# Altium schematic sheet Main.SchDoc
size A4
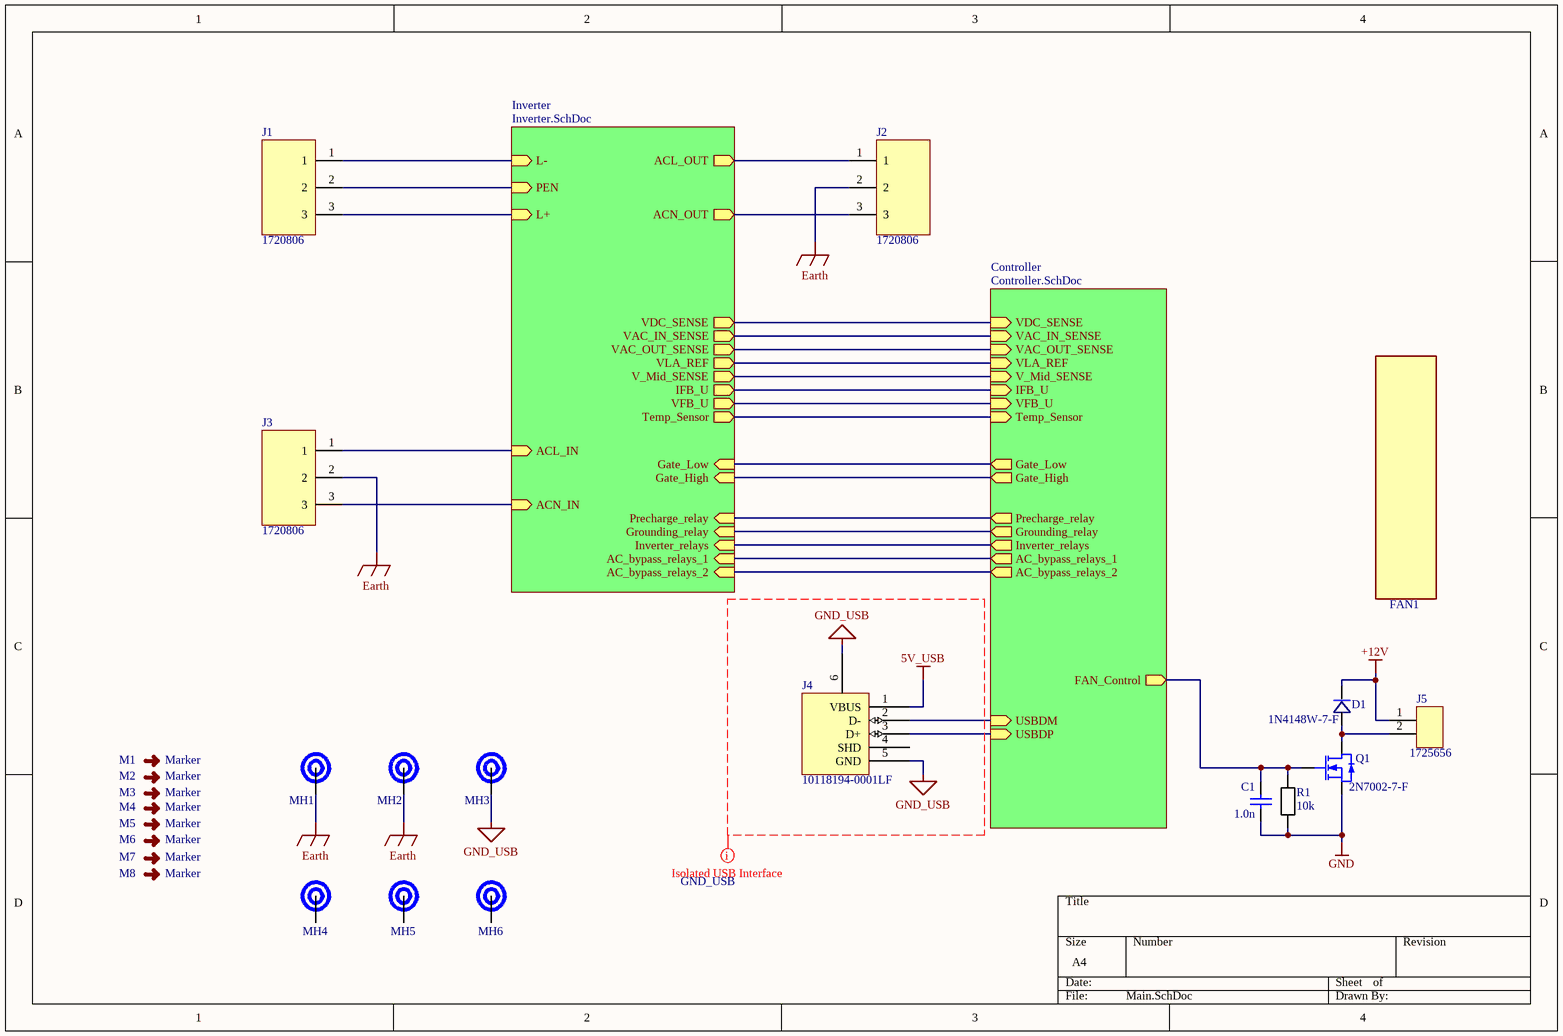
[diagram p0: Main.SchDoc]

## Parts
C1  1.0n  [C0603]
D1  1N4148W-7-F  [SOD123]
FAN1  FAN_60*60mm  [FAN_60*60mm]  (value not drawn)
J1  1720806  [1720806]
J2  1720806  [1720806]
J3  1720806  [1720806]
J4  10118194-0001LF  [10118194-0001LF]
J5  1725656  [1725656]
M1  Marker  [PASSER-KREIS]  (no BOM)
M2  Marker  [PASSER-KREIS]  (no BOM)
M3  Marker  [PASSER-KREIS]  (no BOM)
M4  Marker  [PASSER-KREIS]  (no BOM)
M5  Marker  [PASSER-KREIS]  (no BOM)
M6  Marker  [PASSER-KREIS]  (no BOM)
M7  Marker  [PASSER-KREIS]  (no BOM)
M8  Marker  [PASSER-KREIS]  (no BOM)
MH1  No Fit  [MountingHole]  (value not drawn)
MH2  No Fit  [MountingHole]  (value not drawn)
MH3  No Fit  [MountingHole]  (value not drawn)
MH4  No Fit  [MountingHole_Cutout]  (value not drawn)
MH5  No Fit  [MountingHole_Cutout]  (value not drawn)
MH6  No Fit  [MountingHole_Cutout]  (value not drawn)
Q1  2N7002-7-F  [SOT23-3N]
R1  10k  [R0603]

## Sub-sheets
Controller = Controller.SchDoc: VDC_SENSE (in), VAC_IN_SENSE (in), VAC_OUT_SENSE (in), VLA_REF (in), IFB_U (in), VFB_U (in), Temp_Sensor (in), V_Mid_SENSE (in), Gate_Low (out), Gate_High (out), Precharge_relay (out), Grounding_relay (out), Inverter_relays (out), AC_bypass_relays_1 (out), USBDM (in), USBDP (in), AC_bypass_relays_2 (out), FAN_Control (out)
Inverter = Inverter.SchDoc: L- (in), L+ (in), ACL_OUT (out), ACN_OUT (out), PEN (in), ACL_IN (in), ACN_IN (in), VDC_SENSE (out), VAC_IN_SENSE (out), VAC_OUT_SENSE (out), VLA_REF (out), IFB_U (out), VFB_U (out), Temp_Sensor (out), V_Mid_SENSE (out), Gate_Low (in), Gate_High (in), Precharge_relay (in), Grounding_relay (in), Inverter_relays (in), AC_bypass_relays_1 (in), AC_bypass_relays_2 (in)

## Nets
5V_USB: J4.1(VBUS)
+12V: D1.C J5.1
Earth: J2.2 J3.2 MH1.0 MH2.0
GND: C1.1 Q1.2(S) R1.2
GND_USB: J4.5(GND) J4.6 MH3.0
NetC1_2: C1.2 Q1.1(G) R1.1 ; sheet Controller/FAN_Control
NetD1_A: D1.A J5.2 Q1.3(D)
NetJ1_1: J1.1 ; sheet Inverter/L-
NetJ1_2: J1.2 ; sheet Inverter/PEN
NetJ1_3: J1.3 ; sheet Inverter/L+
NetJ2_1: J2.1 ; sheet Inverter/ACL_OUT
NetJ2_3: J2.3 ; sheet Inverter/ACN_OUT
NetJ3_1: J3.1 ; sheet Inverter/ACL_IN
NetJ3_3: J3.3 ; sheet Inverter/ACN_IN
NetJ4_2: J4.2(D-) ; sheet Controller/USBDM
NetJ4_3: J4.3(D+) ; sheet Controller/USBDP
(unnamed): sheet Controller/VDC_SENSE, sheet Inverter/VDC_SENSE
(unnamed): sheet Controller/VAC_IN_SENSE, sheet Inverter/VAC_IN_SENSE
(unnamed): sheet Controller/VAC_OUT_SENSE, sheet Inverter/VAC_OUT_SENSE
(unnamed): sheet Controller/VLA_REF, sheet Inverter/VLA_REF
(unnamed): sheet Controller/IFB_U, sheet Inverter/IFB_U
(unnamed): sheet Controller/VFB_U, sheet Inverter/VFB_U
(unnamed): sheet Controller/Temp_Sensor, sheet Inverter/Temp_Sensor
(unnamed): sheet Controller/V_Mid_SENSE, sheet Inverter/V_Mid_SENSE
(unnamed): sheet Controller/Gate_Low, sheet Inverter/Gate_Low
(unnamed): sheet Controller/Gate_High, sheet Inverter/Gate_High
(unnamed): sheet Controller/Precharge_relay, sheet Inverter/Precharge_relay
(unnamed): sheet Controller/Grounding_relay, sheet Inverter/Grounding_relay
(unnamed): sheet Controller/Inverter_relays, sheet Inverter/Inverter_relays
(unnamed): sheet Controller/AC_bypass_relays_1, sheet Inverter/AC_bypass_relays_1
(unnamed): sheet Controller/AC_bypass_relays_2, sheet Inverter/AC_bypass_relays_2

Not connected (* = marked no-connect by the designer): J4 4(SHD); MH4 0; MH5 0; MH6 0

## Layout directives
net class GND_USB: 5V_USB, GND_USB

## Library data of the parts
C1 = CAP_YAG_CC0603KRNPO9BN102_NPO: Capacitor 1.0n 0603 +-10% 50V; MFR: Yageo; Type: NPO; Voltage (V): 50; Part Number: CAP_YAG_CC0603KRNPO9BN102_NPO; MPN: CC0603KRNPO9BN102; Category: Capacitor; Package / Case: 0603; Capacitor (Farad): 1.0n; Tolerance: +-10%; Thickness (mm): 0.8; Value: 1.0n
D1 = 1N4148W: Diodes - General Purpose, Power, Switching SURFACE MOUNT FAST SWITCHING DIODE; MFR: Diodes Incorporated; MPN: 1N4148W-7-F; Value: 1N4148W-7-F
J1-J3 = 1720806: Pluggable Terminal Blocks 3 Pos 7.62mm pitch Through Hole Header; MFR: Phoenix Contact; MPN: 1720806; Value: 1720806
J4 = 10118194-0001LF: CONN RCPT USB2.0 MICRO B SMD R/A; MFR: Amphenol FCI; Gender: Receptacle; Current Rating: 1.8A; Connector Type: USB,Receptacle; Number of Contacts: 5; Insulation Resistance: 1GR; Number of Ports: 1; Max Voltage Rating (AC): 100V; Pitch: 0.65mm; Supplier 1: Digi-Key; Supplier Part Number 1: 609-4618-1-ND; MPN: 10118194-0001LF; Stock 1: 145984; Pricing 1: 1=0.42, 10=0.393, 25=0.3536, 50=0.3144, 100=0.3013, 250=0.27512, 500=0.26202 (USD); Mount: Surface Mount,Horizontal; Contact Material: Copper Alloy; Contact Plating: Gold; Number of Terminals: 5; Housing Material: Polymer; Color: Black; Min Operating Temperature: -55°C; Max Operating Temperature: 85°C; Package Quantity: 9600; Packaging: Tape and Reel; Termination: Solder; Orientation: Right Angle; Features: Shielded; Length: 8.05mm; Depth: 5mm; Radiation Hardening: No; Lead Free: Lead Free; Flammability Rating: UL94 V-0; ComponentLink1URL: http://www.amphenol-icc.com/media/wysiwyg/files/drawing/10118194.pdf?src-supplier=Digi-Key; ComponentLink1Description: http://www.amphenol-icc.com/media/wysiwyg/files/drawing/10118194.pdf?src-supplier=Digi-Key; ComponentLink2URL: https://cdn.amphenol-icc.com/media/wysiwyg/files/drawing/10118194.pdf?src-supplier=Mouser; ComponentLink2Description: https://cdn.amphenol-icc.com/media/wysiwyg/files/drawing/10118194.pdf?src-supplier=Mouser; ComponentLink3URL: https://cdn.amphenol-icc.com/media/wysiwyg/files/drawing/10118194.pdf?src-supplier=Avnet; ComponentLink3Description: https://cdn.amphenol-icc.com/media/wysiwyg/files/drawing/10118194.pdf?src-supplier=Avnet; ComponentLink4URL: https://cdn.amphenol-icc.com/media/wysiwyg/files/drawing/10118194.pdf?src-supplier=Verical; ComponentLink4Description: https://cdn.amphenol-icc.com/media/wysiwyg/files/drawing/10118194.pdf?src-supplier=Verical; Value: 10118194-0001LF
J5 = Connector_2Pin: Fixed Terminal Blocks 2P 2.54mm 90DEG; MFR: Phoenix Contact; Value: 1725656; MPN: 1725656
M1-M8 = M: Text Field2: -1; Value: NB
MH1-MH6 = Mounting Hole
Q1 = MOSFET-N: MOSFET N-CH 60V 200MA SOT23-3; MFR: Diodes Incorporated; MPN: 2N7002-7-F; Value: 2N7002-7-F
R1 = RES: 0.1W/ 10kohm±1%; MPN: RC0603FR-0710KL; MFR: Yageo; Value: 10k
FAN1 = FAN_60*60mm: Value: FAN_60*60mm